# EAGLE design protoboard (EAGLE 7.7.0)
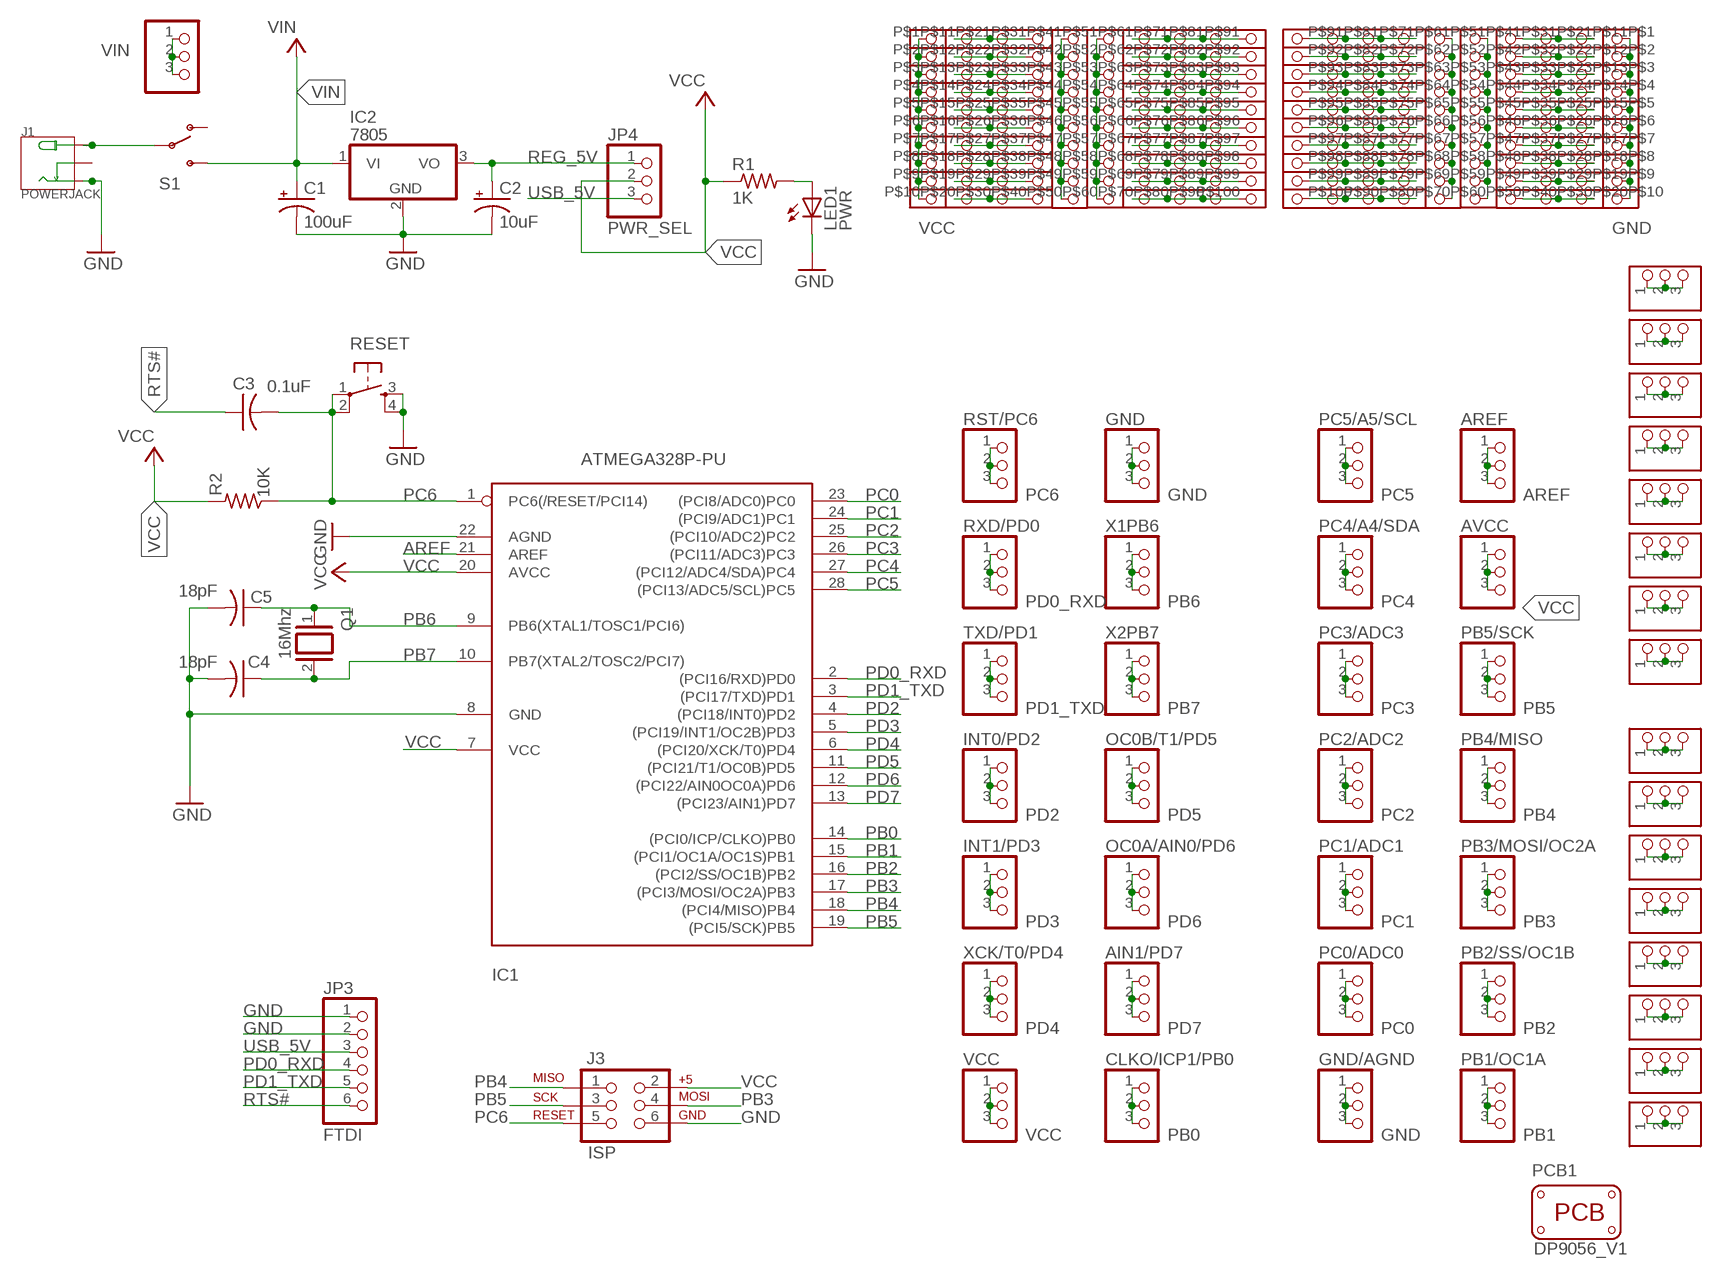
[diagram p0: schematic, sheet 1]

## Parts
AIN1/PD7  PINHD-1X3  [1X03]
AREF  PINHD-1X3  [1X03]
AVCC  PINHD-1X3  [1X03]
C1  100uF  CAP_POLPTH1  [CPOL-RADIAL-100UF-25V]
C2  10uF  CAP_POLPTH2  [CPOL-RADIAL-10UF-25V]
C3  0.1uF  C-US025-025X050  [C025-025X050]
C4  18pF  C-US025-025X050  [C025-025X050]
C5  18pF  C-US025-025X050  [C025-025X050]
CLKO/ICP1/PB0  PINHD-1X3  [1X03]
GND  PINHD-1X3  [1X03]
GND/AGND  PINHD-1X3  [1X03]
IC1  ATMEGA328P-PU  ATMEGA168-20P  [DIL28-3]
IC2  7805  7805T  [TO220H]
INT0/PD2  PINHD-1X3  [1X03]
INT1/PD3  PINHD-1X3  [1X03]
J1  POWERJACK  JACK-DC-3P-3410020P1  [PW-3P-2.1]
J3  ISP  AVR_SPI_PRG_6PTH  [2X3]
JP3  FTDI  PINHD-1X6  [1X06]
JP4  PWR_SEL  PINHD-1X3  [1X03]
LED1  PWR  LED3MM  [LED3MM]
OC0A/AIN0/PD6  PINHD-1X3  [1X03]
OC0B/T1/PD5  PINHD-1X3  [1X03]
PB1/OC1A  PINHD-1X3  [1X03]
PB2/SS/OC1B  PINHD-1X3  [1X03]
PB3/MOSI/OC2A  PINHD-1X3  [1X03]
PB4/MISO  PINHD-1X3  [1X03]
PB5/SCK  PINHD-1X3  [1X03]
PC0/ADC0  PINHD-1X3  [1X03]
PC1/ADC1  PINHD-1X3  [1X03]
PC2/ADC2  PINHD-1X3  [1X03]
PC3/ADC3  PINHD-1X3  [1X03]
PC4/A4/SDA  PINHD-1X3  [1X03]
PC5/A5/SCL  PINHD-1X3  [1X03]
PCB1  PCB_DP_RECTANGLE-56X90  [DP9056_V1]
Q1  16Mhz  XTAL/S  [QS]
R1  1K  RESISTOR-1/4W  [0207/7]
R2  10K  RESISTOR-1/4W  [0207/7]
RESET  TAC_SWITCHPTH  [TACTILE-PTH]
RST/PC6  PINHD-1X3  [1X03]
RXD/PD0  PINHD-1X3  [1X03]
S1  SWITCH-SPDTPTH  [SWITCH-SPDT]
TXD/PD1  PINHD-1X3  [1X03]
U$1  PROTOFIELD-10X10  [PROTOFIELD-10X10]
U$3  PROTOFIELD-10X10  [PROTOFIELD-10X10]
U$4  PROTOFIELD-3  [PROTOFIELD-3]
U$5  PROTOFIELD-3  [PROTOFIELD-3]
U$6  PROTOFIELD-3  [PROTOFIELD-3]
U$7  PROTOFIELD-3  [PROTOFIELD-3]
U$8  PROTOFIELD-3  [PROTOFIELD-3]
U$9  PROTOFIELD-3  [PROTOFIELD-3]
U$10  PROTOFIELD-3  [PROTOFIELD-3]
U$11  PROTOFIELD-3  [PROTOFIELD-3]
U$12  PROTOFIELD-3  [PROTOFIELD-3]
U$13  PROTOFIELD-3  [PROTOFIELD-3]
U$14  PROTOFIELD-3  [PROTOFIELD-3]
U$15  PROTOFIELD-3  [PROTOFIELD-3]
U$16  PROTOFIELD-3  [PROTOFIELD-3]
U$17  PROTOFIELD-3  [PROTOFIELD-3]
U$18  PROTOFIELD-3  [PROTOFIELD-3]
U$19  PROTOFIELD-3  [PROTOFIELD-3]
VCC  PINHD-1X3  [1X03]
VIN  +9V  PINHD-1X3  [1X03]
X1PB6  PINHD-1X3  [1X03]
X2PB7  PINHD-1X3  [1X03]
XCK/T0/PD4  PINHD-1X3  [1X03]

## Nets
AREF: AREF.1 AREF.2 AREF.3 IC1.21(AREF)
GND: C1.2(-) C2.2(-) C4.2 C5.2 GND.1 GND.2 GND.3 GND/AGND.1 GND/AGND.2 GND/AGND.3 IC1.8(GND) IC1.22(AGND) IC2.2(GND) J1.-1(-) J3.6 JP3.1 JP3.2 LED1.K(C) RESET.3 RESET.4 U$3.P$1 U$3.P$2 U$3.P$3 U$3.P$4 U$3.P$5 U$3.P$6 U$3.P$7 U$3.P$8 U$3.P$9 U$3.P$10
N$1 [supply]: J1.+ S1.2(P)
N$2: LED1.A R1.2
N$4: U$4.1 U$4.2 U$4.3
N$5: U$5.1 U$5.2 U$5.3
N$6: U$6.1 U$6.2 U$6.3
N$7: U$7.1 U$7.2 U$7.3
N$8: U$8.1 U$8.2 U$8.3
N$9: U$9.1 U$9.2 U$9.3
N$10: U$10.1 U$10.2 U$10.3
N$11: U$11.1 U$11.2 U$11.3
N$12: U$12.1 U$12.2 U$12.3
N$13: U$13.1 U$13.2 U$13.3
N$14: U$14.1 U$14.2 U$14.3
N$15: U$15.1 U$15.2 U$15.3
N$16: U$16.1 U$16.2 U$16.3
N$17: U$17.1 U$17.2 U$17.3
N$18: U$18.1 U$18.2 U$18.3
N$19: U$19.1 U$19.2 U$19.3
N$20: U$1.P$41 U$1.P$42 U$1.P$43 U$1.P$44 U$1.P$45 U$1.P$46 U$1.P$47 U$1.P$48 U$1.P$49 U$1.P$50
N$21: U$1.P$51 U$1.P$52 U$1.P$53 U$1.P$54 U$1.P$55 U$1.P$56 U$1.P$57 U$1.P$58 U$1.P$59 U$1.P$60
N$22: U$1.P$61 U$1.P$71 U$1.P$81 U$1.P$91
N$23: U$1.P$62 U$1.P$72 U$1.P$82 U$1.P$92
N$24: U$1.P$63 U$1.P$73 U$1.P$83 U$1.P$93
N$25: U$1.P$64 U$1.P$74 U$1.P$84 U$1.P$94
N$26: U$1.P$65 U$1.P$75 U$1.P$85 U$1.P$95
N$27: U$1.P$66 U$1.P$76 U$1.P$86 U$1.P$96
N$28: U$1.P$67 U$1.P$77 U$1.P$87 U$1.P$97
N$29: U$1.P$68 U$1.P$78 U$1.P$88 U$1.P$98
N$30: U$1.P$69 U$1.P$79 U$1.P$89 U$1.P$99
N$31: U$1.P$70 U$1.P$80 U$1.P$90 U$1.P$100
N$32: U$1.P$11 U$1.P$21 U$1.P$31
N$33: U$1.P$12 U$1.P$22 U$1.P$32
N$34: U$1.P$13 U$1.P$23 U$1.P$33
N$35: U$1.P$14 U$1.P$24 U$1.P$34
N$36: U$1.P$15 U$1.P$25 U$1.P$35
N$37: U$1.P$16 U$1.P$26 U$1.P$36
N$38: U$1.P$17 U$1.P$27 U$1.P$37
N$39: U$1.P$18 U$1.P$28 U$1.P$38
N$40: U$1.P$19 U$1.P$29 U$1.P$39
N$41: U$1.P$20 U$1.P$30 U$1.P$40
N$42: U$3.P$61 U$3.P$71 U$3.P$81 U$3.P$91
N$43: U$3.P$62 U$3.P$72 U$3.P$82 U$3.P$92
N$44: U$3.P$63 U$3.P$73 U$3.P$83 U$3.P$93
N$45: U$3.P$64 U$3.P$74 U$3.P$84 U$3.P$94
N$46: U$3.P$65 U$3.P$75 U$3.P$85 U$3.P$95
N$47: U$3.P$66 U$3.P$76 U$3.P$86 U$3.P$96
N$48: U$3.P$67 U$3.P$77 U$3.P$87 U$3.P$97
N$49: U$3.P$68 U$3.P$78 U$3.P$88 U$3.P$98
N$50: U$3.P$69 U$3.P$79 U$3.P$89 U$3.P$99
N$51: U$3.P$70 U$3.P$80 U$3.P$90 U$3.P$100
N$52: U$3.P$51 U$3.P$52 U$3.P$53 U$3.P$54 U$3.P$55 U$3.P$56 U$3.P$57 U$3.P$58 U$3.P$59 U$3.P$60
N$53: U$3.P$41 U$3.P$42 U$3.P$43 U$3.P$44 U$3.P$45 U$3.P$46 U$3.P$47 U$3.P$48 U$3.P$49 U$3.P$50
N$54: U$3.P$11 U$3.P$21 U$3.P$31
N$55: U$3.P$12 U$3.P$22 U$3.P$32
N$56: U$3.P$13 U$3.P$23 U$3.P$33
N$57: U$3.P$14 U$3.P$24 U$3.P$34
N$58: U$3.P$15 U$3.P$25 U$3.P$35
N$59: U$3.P$16 U$3.P$26 U$3.P$36
N$60: U$3.P$17 U$3.P$27 U$3.P$37
N$61: U$3.P$18 U$3.P$28 U$3.P$38
N$62: U$3.P$19 U$3.P$29 U$3.P$39
N$63: U$3.P$20 U$3.P$30 U$3.P$40
PB0: CLKO/ICP1/PB0.1 CLKO/ICP1/PB0.2 CLKO/ICP1/PB0.3 IC1.14((PCI0/ICP/CLKO)PB0)
PB1: IC1.15((PCI1/OC1A/OC1S)PB1) PB1/OC1A.1 PB1/OC1A.2 PB1/OC1A.3
PB2: IC1.16((PCI2/SS/OC1B)PB2) PB2/SS/OC1B.1 PB2/SS/OC1B.2 PB2/SS/OC1B.3
PB3: IC1.17((PCI3/MOSI/OC2A)PB3) J3.4 PB3/MOSI/OC2A.1 PB3/MOSI/OC2A.2 PB3/MOSI/OC2A.3
PB4: IC1.18((PCI4/MISO)PB4) J3.1 PB4/MISO.1 PB4/MISO.2 PB4/MISO.3
PB5: IC1.19((PCI5/SCK)PB5) J3.3 PB5/SCK.1 PB5/SCK.2 PB5/SCK.3
PB6: C5.1 IC1.9(PB6(XTAL1/TOSC1/PCI6)) Q1.1 X1PB6.1 X1PB6.2 X1PB6.3
PB7: C4.1 IC1.10(PB7(XTAL2/TOSC2/PCI7)) Q1.2 X2PB7.1 X2PB7.2 X2PB7.3
PC0: IC1.23((PCI8/ADC0)PC0) PC0/ADC0.1 PC0/ADC0.2 PC0/ADC0.3
PC1: IC1.24((PCI9/ADC1)PC1) PC1/ADC1.1 PC1/ADC1.2 PC1/ADC1.3
PC2: IC1.25((PCI10/ADC2)PC2) PC2/ADC2.1 PC2/ADC2.2 PC2/ADC2.3
PC3: IC1.26((PCI11/ADC3)PC3) PC3/ADC3.1 PC3/ADC3.2 PC3/ADC3.3
PC4: IC1.27((PCI12/ADC4/SDA)PC4) PC4/A4/SDA.1 PC4/A4/SDA.2 PC4/A4/SDA.3
PC5: IC1.28((PCI13/ADC5/SCL)PC5) PC5/A5/SCL.1 PC5/A5/SCL.2 PC5/A5/SCL.3
PC6: C3.2 IC1.1(PC6(/RESET/PCI14)) J3.5 R2.1 RESET.1 RESET.2 RST/PC6.1 RST/PC6.2 RST/PC6.3
PD0_RXD: IC1.2((PCI16/RXD)PD0) JP3.4 RXD/PD0.1 RXD/PD0.2 RXD/PD0.3
PD1_TXD: IC1.3((PCI17/TXD)PD1) JP3.5 TXD/PD1.1 TXD/PD1.2 TXD/PD1.3
PD2: IC1.4((PCI18/INT0)PD2) INT0/PD2.1 INT0/PD2.2 INT0/PD2.3
PD3: IC1.5((PCI19/INT1/OC2B)PD3) INT1/PD3.1 INT1/PD3.2 INT1/PD3.3
PD4: IC1.6((PCI20/XCK/T0)PD4) XCK/T0/PD4.1 XCK/T0/PD4.2 XCK/T0/PD4.3
PD5: IC1.11((PCI21/T1/OC0B)PD5) OC0B/T1/PD5.1 OC0B/T1/PD5.2 OC0B/T1/PD5.3
PD6: IC1.12((PCI22/AIN0OC0A)PD6) OC0A/AIN0/PD6.1 OC0A/AIN0/PD6.2 OC0A/AIN0/PD6.3
PD7: AIN1/PD7.1 AIN1/PD7.2 AIN1/PD7.3 IC1.13((PCI23/AIN1)PD7)
REG_5V: C2.1(+) IC2.3(VO) JP4.1
RTS#: C3.1 JP3.6
USB_5V: JP3.3 JP4.3
VCC: AVCC.1 AVCC.2 AVCC.3 IC1.7(VCC) IC1.20(AVCC) J3.2 JP4.2 R1.1 R2.2 U$1.P$1 U$1.P$2 U$1.P$3 U$1.P$4 U$1.P$5 U$1.P$6 U$1.P$7 U$1.P$8 U$1.P$9 U$1.P$10 VCC.1 VCC.2 VCC.3
VIN [supply]: C1.1(+) IC2.1(VI) S1.3(S) VIN.1 VIN.2 VIN.3
Unconnected: J1.-2(CDN) S1.1(O)

## Library data of the parts
AIN1/PD7 AREF AVCC CLKO/ICP1/PB0 GND GND/AGND INT0/PD2 INT1/PD3 OC0A/AIN0/PD6 OC0B/T1/PD5 PB1/OC1A PB2/SS/OC1B PB3/MOSI/OC2A PB4/MISO PB5/SCK PC0/ADC0 PC1/ADC1 PC2/ADC2 PC3/ADC3 PC4/A4/SDA PC5/A5/SCL RST/PC6 RXD/PD0 TXD/PD1 VCC VIN X1PB6 X2PB7 XCK/T0/PD4 = ubiyubix:PINHD-1X3
C1 C2 = SparkFun-Passives:CAP_POL: Capacitor Polarized These are standard SMD and PTH capacitors. Normally 10uF, 47uF, and 100uF in electrolytic and tantalum varieties. Always verify the external diameter of the through hole cap, it varies with capacity, voltage, and manufacturer. The EIA devices should be standard.
C3-C5 = rcl:C-US: CAPACITOR, American symbol
IC1 = adafruit:ATMEGA168*P: MICROCONTROLLER 16 kBytes FLASH 1 kBytes SRAM 512 Bytes EEPROM USART 8-channel 10 bit ADC
IC2 = linear:78*: Positive VOLTAGE REGULATOR Source: http://cache.national.com/ds/LM/LM78L05.pdf http://www.fairchildsemi.com/ds/LM/LM7805.pdf
J1 = Connector:JACK-DC-3P
J3 = SparkFun-Connectors:AVR_SPI_PRG_6: AVR ISP 6 Pin This is the reduced ISP connector for AVR programming. Common on Arduino. This footprint will take up less PCB space and can be used with a 10-pin to 6-pin adapter such as SKU: BOB-08508
JP3 = adafruit:PINHD-1X6: PIN HEADER
JP4 = adafruit:PINHD-1X3: PIN HEADER
LED1 = adafruit:LED: LED OSRAM: - CHIPLED LG R971, LG N971, LY N971, LG Q971, LY Q971, LO R971, LY R971 LH N974, LH R974 LS Q976, LO Q976, LY Q976 LO Q996 - Hyper CHIPLED LW Q18S LB Q993, LB Q99A, LB R99A - SideLED LS A670, LO A670, LY A670, LG A670, LP A670 LB A673, LV A673, LT A673, LW A673 LH A674 LY A675 LS A676, LA A676, LO A676, LY A676, LW A676 LS A679, LY A679, LG A679 - Hyper Micro SIDELED® LS Y876, LA Y876, LO Y876, LY Y876 LT Y87S - SmartLED LW L88C, LW L88S LB L89C, LB L89S, LG L890 LS L89K, LO L89K, LY L89K LS L896, LA L896, LO L896, LY L896 - TOPLED LS T670, LO T670, LY T670, LG T670, LP T670 LSG T670, LSP T670, LSY T670, LOP T670, LYG T670 LG T671, LOG T671, LSG T671 LB T673, LV T673, LT T673, LW T673 LH T674 LS T676, LA T676, LO T676, LY T676, LB T676, LH T676, LSB T676, LW T676 LB T67C, LV T67C, LT T67C, LS T67K, LO T67K, LY T67K, LW E67C LS E67B, LA E67B, LO E67B, LY E67B, LB E67C, LV E67C, LT E67C LW T67C LS T679, LY T679, LG T679 LS T770, LO T770, LY T770, LG T770, LP T770 LB T773, LV T773, LT T773, LW T773 LH T774 LS E675, LA E675, LY E675, LS T675 LS T776, LA T776, LO T776, LY T776, LB T776 LHGB T686 LT T68C, LB T68C - Hyper Mini TOPLED® LB M676 - Mini TOPLED Santana® LG M470 LS M47K, LO M47K, LY M47K Source: http://www.osram.convergy.de/
PCB1 = dp_devices:PCB_DP_RECTANGLE: Dangerous Prototypes Standard Rectangular PCB sizes; PCB_SIZE: DP9056_V1
Q1 = SmartPrj:XTAL/S: CRYSTAL
R1 R2 = ubiyubix:RESISTOR-1/4W
RESET = SparkFun-Electromechanical:TAC_SWITCH: Momentary Switch Button commonly used for reset or general input. Spark Fun Electronics SKU : COM-00097
S1 = ubiyubix:SWITCH-SPDT: SPST Switch Simple slide switch. Spark Fun Electronics SKU : COM-00102
U$1 U$3 = ubiyubix:PROTOFIELD-10X10
U$4-U$19 = ubiyubix:PROTOFIELD-3

## Net classes
0 default: width 0.305 mm, clearance 0.305 mm
1 supply: width 0.406 mm

## Board
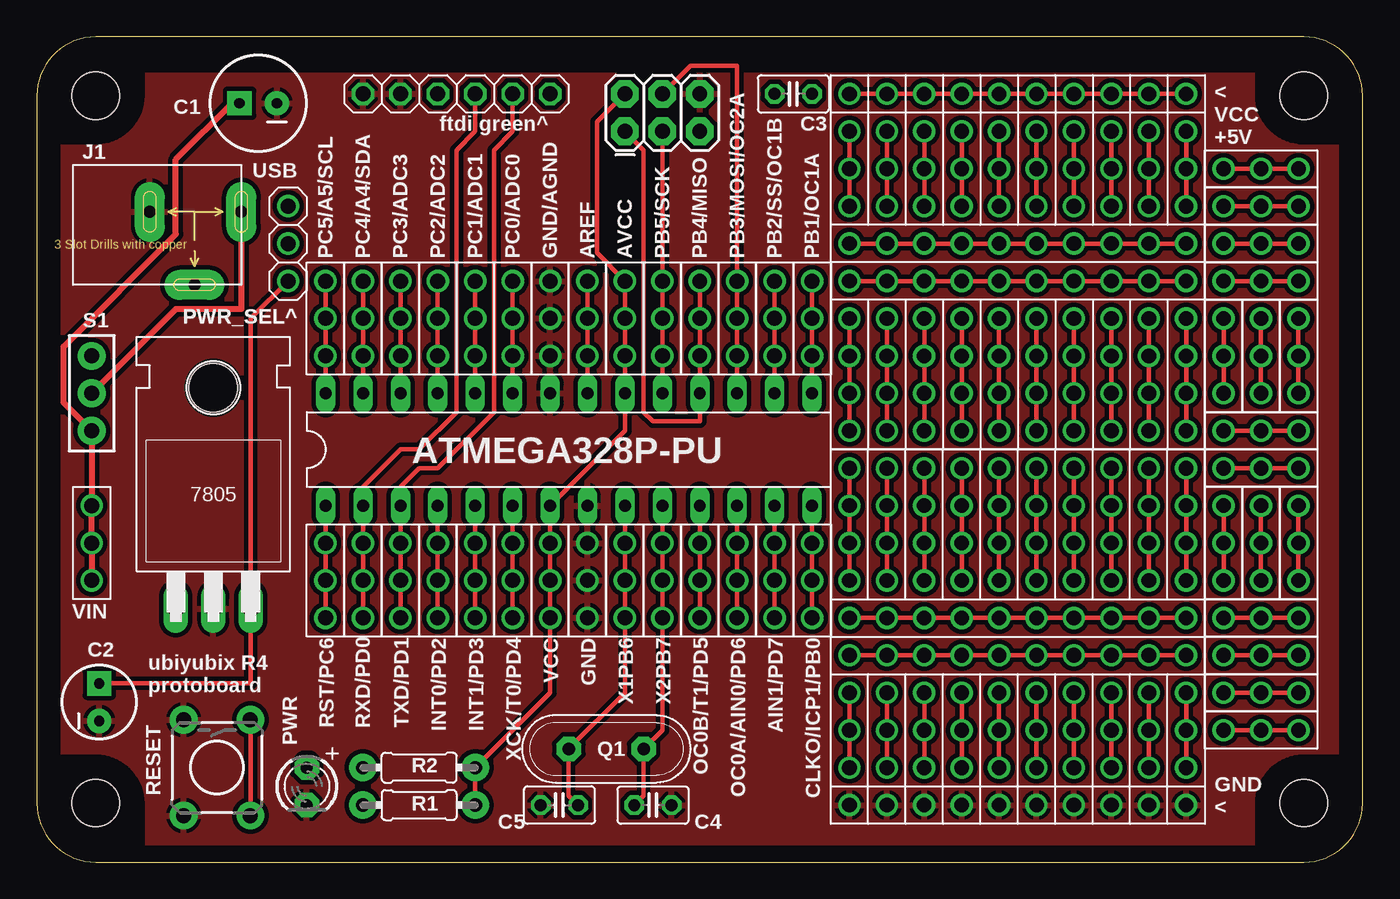
[diagram p1: board, top side]
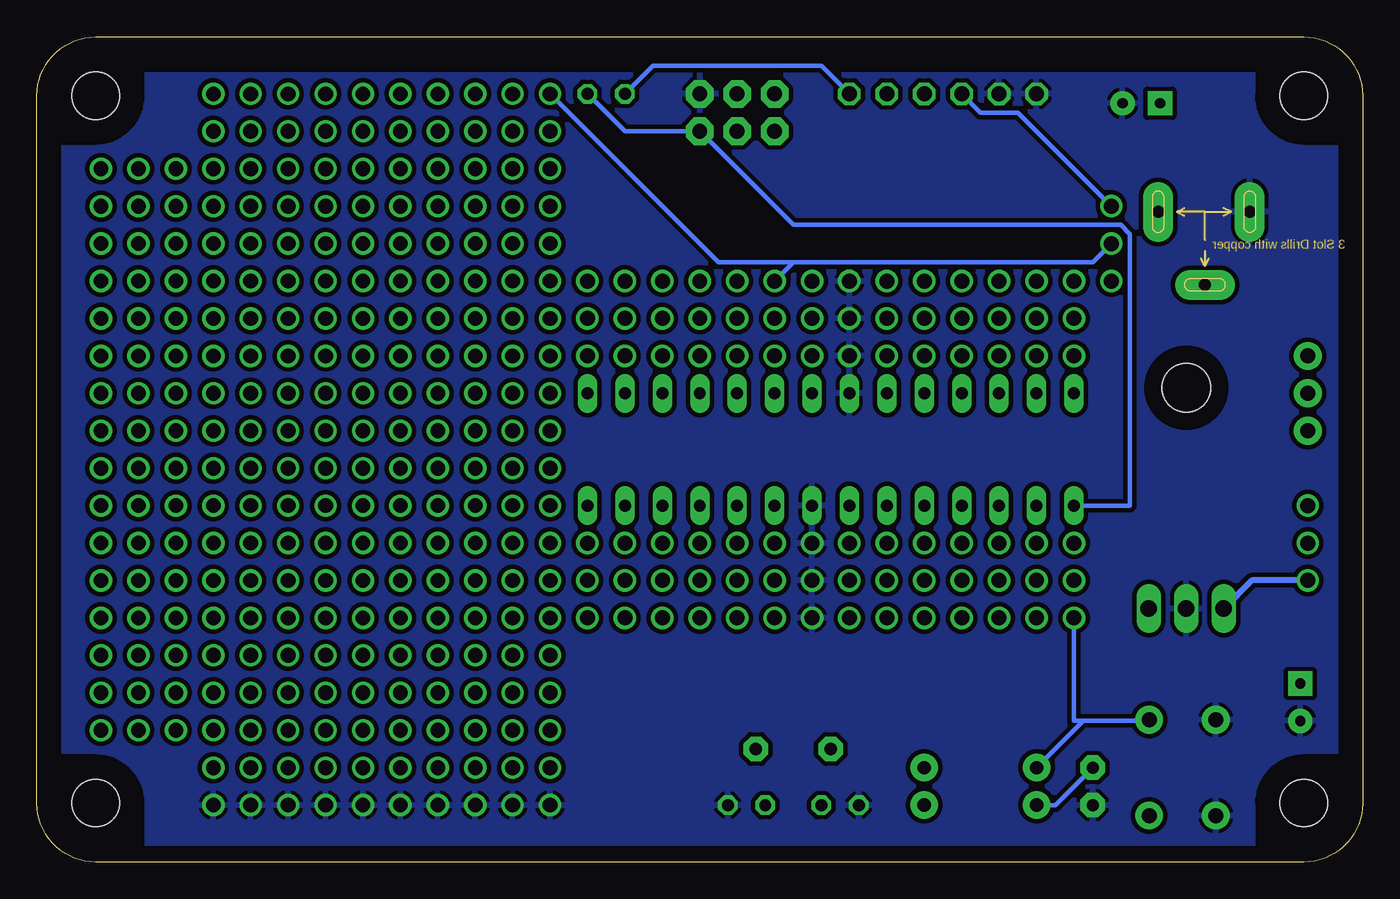
[diagram p2: board, bottom side, seen from below]

Size 90 x 56 mm. Coordinates in mm from the lower left corner, seen from the top.
Copper layers (1*16): Top 0.035mm / dielectric 1.5mm / Bottom 0.035mm
Design rules "SeeedStudio_2layer_DRU_no_angle_20140221": minimum track width 6mil, minimum drill 12mil, track to track 6mil, track to pad 6mil, pad to pad 6mil, via to via 6mil, smd to smd 0mil, copper to edge 10mil, drill to drill 10mil, minimum pad ring 10mil, minimum via ring 6mil, stop-mask expansion 2mil, vias tented up to drill 100mil, thermal gap 10mil

### Footprints (pad centres in the part's own frame; a part is rotated, then mirrored left to right if it is on the bottom)
1X03 = drill 1.016: 1 -2.54,0; 2 0,0; 3 2.54,0
CPOL-RADIAL-100UF-25V = drill 0.7 pad 1.651 square: 1 1.27,0 | drill 0.7 pad 1.651: 2 -1.27,0
CPOL-RADIAL-10UF-25V = drill 0.7 pad 1.651 square: 1 1.27,0 | drill 0.7 pad 1.651: 2 -1.27,0
C025-025X050 = drill 0.813 octagon: 1 -1.27,0; 2 1.27,0
DIL28-3 = drill 0.813 long: 1 -16.51,-3.81; 2 -13.97,-3.81; 3 -11.43,-3.81; 4 -8.89,-3.81; 5 -6.35,-3.81; 6 -3.81,-3.81; 7 -1.27,-3.81; 8 1.27,-3.81; 9 3.81,-3.81; 10 6.35,-3.81; 11 8.89,-3.81; 12 11.43,-3.81; 13 13.97,-3.81; 14 16.51,-3.81; 15 16.51,3.81; 16 13.97,3.81; 17 11.43,3.81; 18 8.89,3.81; 19 6.35,3.81; 20 3.81,3.81; 21 1.27,3.81; 22 -1.27,3.81; 23 -3.81,3.81; 24 -6.35,3.81; 25 -8.89,3.81; 26 -11.43,3.81; 27 -13.97,3.81; 28 -16.51,3.81
TO220H = drill 1.118 long: 1 -2.54,-10.16; 2 0,-10.16; 3 2.54,-10.16 | hole 3.302: 0,4.826
PW-3P-2.1 = drill 0.813 pad 2.032 long: + 6.985,0.889; -1 0.762,0.889; -2 3.81,-4.064
2X3 = drill 1.016 pad 1.88 octagon: 1 0,0; 2 0,2.54; 3 2.54,0; 4 2.54,2.54; 5 5.08,0; 6 5.08,2.54
1X06 = drill 1.016 octagon: 1 -6.35,0; 2 -3.81,0; 3 -1.27,0; 4 1.27,0; 5 3.81,0; 6 6.35,0
LED3MM = drill 0.813 pad 1.676 octagon: A -1.27,0; K 1.27,0
DP9056_V1 = hole 3.2: -41,-24; 41,-24; 41,24; -41,24
QS = drill 0.85 pad 1.676 octagon: 1 -2.54,0; 2 2.54,0
0207/7 = drill 0.9 pad 1.88: 1 -3.81,0; 2 3.81,0
TACTILE-PTH = drill 1.016 pad 1.88: 1 -3.251,2.261; 2 3.251,2.261; 3 -3.251,-2.261; 4 3.251,-2.261
SWITCH-SPDT = drill 1.016 pad 1.88: 1 0,2.54; 2 0,0; 3 0,-2.54
PROTOFIELD-10X10 = drill 1: P$1 -11.43,11.43; P$2 -11.43,8.89; P$3 -11.43,6.35; P$4 -11.43,3.81; P$5 -11.43,1.27; P$6 -11.43,-1.27; P$7 -11.43,-3.81; P$8 -11.43,-6.35; P$9 -11.43,-8.89; P$10 -11.43,-11.43; P$11 -8.89,11.43; P$12 -8.89,8.89; P$13 -8.89,6.35; P$14 -8.89,3.81; P$15 -8.89,1.27; P$16 -8.89,-1.27; P$17 -8.89,-3.81; P$18 -8.89,-6.35; P$19 -8.89,-8.89; P$20 -8.89,-11.43; P$21 -6.35,11.43; P$22 -6.35,8.89; P$23 -6.35,6.35; P$24 -6.35,3.81; P$25 -6.35,1.27; P$26 -6.35,-1.27; P$27 -6.35,-3.81; P$28 -6.35,-6.35; P$29 -6.35,-8.89; P$30 -6.35,-11.43; P$31 -3.81,11.43; P$32 -3.81,8.89; P$33 -3.81,6.35; P$34 -3.81,3.81; P$35 -3.81,1.27; P$36 -3.81,-1.27; P$37 -3.81,-3.81; P$38 -3.81,-6.35; P$39 -3.81,-8.89; P$40 -3.81,-11.43; P$41 -1.27,11.43; P$42 -1.27,8.89; P$43 -1.27,6.35; P$44 -1.27,3.81; P$45 -1.27,1.27; P$46 -1.27,-1.27; P$47 -1.27,-3.81; P$48 -1.27,-6.35; P$49 -1.27,-8.89; P$50 -1.27,-11.43; P$51 1.27,11.43; P$52 1.27,8.89; P$53 1.27,6.35; P$54 1.27,3.81; P$55 1.27,1.27; P$56 1.27,-1.27; P$57 1.27,-3.81; P$58 1.27,-6.35; P$59 1.27,-8.89; P$60 1.27,-11.43; P$61 3.81,11.43; P$62 3.81,8.89; P$63 3.81,6.35; P$64 3.81,3.81; P$65 3.81,1.27; P$66 3.81,-1.27; P$67 3.81,-3.81; P$68 3.81,-6.35; P$69 3.81,-8.89; P$70 3.81,-11.43; P$71 6.35,11.43; P$72 6.35,8.89; P$73 6.35,6.35; P$74 6.35,3.81; P$75 6.35,1.27; P$76 6.35,-1.27; P$77 6.35,-3.81; P$78 6.35,-6.35; P$79 6.35,-8.89; P$80 6.35,-11.43; P$81 8.89,11.43; P$82 8.89,8.89; P$83 8.89,6.35; P$84 8.89,3.81; P$85 8.89,1.27; P$86 8.89,-1.27; P$87 8.89,-3.81; P$88 8.89,-6.35; P$89 8.89,-8.89; P$90 8.89,-11.43; P$91 11.43,11.43; P$92 11.43,8.89; P$93 11.43,6.35; P$94 11.43,3.81; P$95 11.43,1.27; P$96 11.43,-1.27; P$97 11.43,-3.81; P$98 11.43,-6.35; P$99 11.43,-8.89; P$100 11.43,-11.43
PROTOFIELD-3 = drill 1: 1 0,2.54; 2 0,0; 3 0,-2.54

### Placement (x,y rotation side)
AIN1/PD7  50.08,19.11 90 top
AREF  37.38,36.89 90 top
AVCC  39.92,36.89 90 top
C1  15.03,51.5 180 top
C2  4.23,10.85 90 top
C3  51.35,52.13 0 top
C4  41.83,3.87 0 top
C5  35.48,3.87 180 top
CLKO/ICP1/PB0  52.62,19.11 90 top
GND  37.38,19.11 90 top
GND/AGND  34.84,36.89 90 top
IC1  36.11,28 0 top
IC2  11.98,27.36 0 top
INT0/PD2  27.22,19.11 90 top
INT1/PD3  29.76,19.11 90 top
J1  6.9,43.24 0 top
J3  39.92,49.59 0 top
JP3  28.49,52.13 0 top
JP4  17.06,41.97 90 top
LED1  18.33,5.14 270 top
OC0A/AIN0/PD6  47.54,19.11 90 top
OC0B/T1/PD5  45,19.11 90 top
PB1/OC1A  52.62,36.89 90 top
PB2/SS/OC1B  50.08,36.89 90 top
PB3/MOSI/OC2A  47.54,36.89 90 top
PB4/MISO  45,36.89 90 top
PB5/SCK  42.46,36.89 90 top
PC0/ADC0  32.3,36.89 90 top
PC1/ADC1  29.76,36.89 90 top
PC2/ADC2  27.22,36.89 90 top
PC3/ADC3  24.68,36.89 90 top
PC4/A4/SDA  22.14,36.89 90 top
PC5/A5/SCL  19.6,36.89 90 top
PCB1  45,28 0 top
Q1  38.65,7.68 0 top
R1  25.95,3.87 180 top
R2  25.95,6.41 0 top
RESET  12.23,6.41 270 top
RST/PC6  19.6,19.11 90 top
RXD/PD0  22.14,19.11 90 top
S1  3.73,31.81 0 top
TXD/PD1  24.68,19.11 90 top
U$1  66.59,40.7 270 top
U$3  66.59,15.3 90 top
U$4  83.1,47.05 90 top
U$5  83.1,44.51 90 top
U$6  83.1,41.97 90 top
U$7  83.1,39.43 90 top
U$8  83.1,29.27 270 top
U$9  85.64,34.35 180 top
U$10  83.1,34.35 180 top
U$11  80.56,34.35 180 top
U$12  83.1,26.73 90 top
U$13  80.56,21.65 180 top
U$14  83.1,21.65 180 top
U$15  85.64,21.65 180 top
U$16  83.1,16.57 90 top
U$17  83.1,14.03 90 top
U$18  83.1,11.49 90 top
U$19  83.1,8.95 90 top
VCC  34.84,19.11 90 top
VIN  3.73,21.65 270 top
X1PB6  39.92,19.11 90 top
X2PB7  42.46,19.11 90 top
XCK/T0/PD4  32.3,19.11 90 top

### Tracks (layer width: path | path; a pad name or v marks a point on that pad's centre or on a via)
AREF
  Top 0.305: IC1.21 AREF.1 AREF.2 AREF.3
GND
  pour Top (isolate 0.305): 3.09,53.4 86.91,53.4 arc-90 88.18,52.13 88.18,2.6 arc-90 86.91,1.33 3.09,1.33 arc-90 1.82,2.6 1.82,52.13 arc90
  pour Bottom (isolate 0.305): 3.09,53.4 85.64,53.4 arc-90 88.18,50.86 88.18,2.6 arc-90 86.91,1.33 3.09,1.33 arc-90 1.82,2.6 1.82,52.13 arc-90
N$1
  Top 0.406: S1.2 9.44,37.53 13.89,37.53 J1.+
N$2
  Bottom 0.305: LED1.A 20.87,3.87 R1.2
N$4
  Top 0.305: U$4.1 U$4.2 U$4.3
N$5
  Top 0.305: U$5.1 U$5.2 U$5.3
N$6
  Top 0.305: U$6.1 U$6.2 U$6.3
N$7
  Top 0.305: U$7.1 U$7.2 U$7.3
N$8
  Top 0.305: U$8.3 U$8.2 U$8.1
N$9
  Top 0.305: U$9.1 U$9.2 U$9.3
N$10
  Top 0.305: U$10.1 U$10.2 U$10.3
N$11
  Top 0.305: U$11.1 U$11.2 U$11.3
N$12
  Top 0.305: U$12.1 U$12.2 U$12.3
N$13
  Top 0.305: U$13.1 U$13.2 U$13.3
N$14
  Top 0.305: U$14.1 U$14.2 U$14.3
N$15
  Top 0.305: U$15.1 U$15.2 U$15.3
N$16
  Top 0.305: U$16.1 U$16.2 U$16.3
N$17
  Top 0.305: U$17.1 U$17.2 U$17.3
N$18
  Top 0.305: U$18.1 U$18.2 U$18.3
N$19
  Top 0.305: U$19.1 U$19.2 U$19.3
N$20
  Top 0.305: U$1.P$50 U$1.P$49 U$1.P$48 U$1.P$47 U$1.P$46 U$1.P$45 U$1.P$44 U$1.P$43 U$1.P$42 U$1.P$41
N$21
  Top 0.305: U$1.P$60 U$1.P$59 U$1.P$58 U$1.P$57 U$1.P$56 U$1.P$55 U$1.P$54 U$1.P$53 U$1.P$52 U$1.P$51
N$22
  Top 0.305: U$1.P$91 U$1.P$81 U$1.P$71 U$1.P$61
N$23
  Top 0.305: U$1.P$92 U$1.P$82 U$1.P$72 U$1.P$62
N$24
  Top 0.305: U$1.P$93 U$1.P$83 U$1.P$73 U$1.P$63
N$25
  Top 0.305: U$1.P$94 U$1.P$84 U$1.P$74 U$1.P$64
N$26
  Top 0.305: U$1.P$95 U$1.P$85 U$1.P$75 U$1.P$65
N$27
  Top 0.305: U$1.P$96 U$1.P$86 U$1.P$76 U$1.P$66
N$28
  Top 0.305: U$1.P$97 U$1.P$87 U$1.P$77 U$1.P$67
N$29
  Top 0.305: U$1.P$98 U$1.P$88 U$1.P$78 U$1.P$68
N$30
  Top 0.305: U$1.P$99 U$1.P$89 U$1.P$79 U$1.P$69
N$31
  Top 0.305: U$1.P$100 U$1.P$90 U$1.P$80 U$1.P$70
N$32
  Top 0.305: U$1.P$31 U$1.P$21 U$1.P$11
N$33
  Top 0.305: U$1.P$32 U$1.P$22 U$1.P$12
N$34
  Top 0.305: U$1.P$33 U$1.P$23 U$1.P$13
N$35
  Top 0.305: U$1.P$34 U$1.P$24 U$1.P$14
N$36
  Top 0.305: U$1.P$35 U$1.P$25 U$1.P$15
N$37
  Top 0.305: U$1.P$36 U$1.P$26 U$1.P$16
N$38
  Top 0.305: U$1.P$37 U$1.P$27 U$1.P$17
N$39
  Top 0.305: U$1.P$38 U$1.P$28 U$1.P$18
N$40
  Top 0.305: U$1.P$39 U$1.P$29 U$1.P$19
N$41
  Top 0.305: U$1.P$40 U$1.P$30 U$1.P$20
N$42
  Top 0.305: U$3.P$61 U$3.P$71 U$3.P$81 U$3.P$91
N$43
  Top 0.305: U$3.P$62 U$3.P$72 U$3.P$82 U$3.P$92
N$44
  Top 0.305: U$3.P$63 U$3.P$73 U$3.P$83 U$3.P$93
N$45
  Top 0.305: U$3.P$64 U$3.P$74 U$3.P$84 U$3.P$94
N$46
  Top 0.305: U$3.P$65 U$3.P$75 U$3.P$85 U$3.P$95
N$47
  Top 0.305: U$3.P$66 U$3.P$76 U$3.P$86 U$3.P$96
N$48
  Top 0.305: U$3.P$67 U$3.P$77 U$3.P$87 U$3.P$97
N$49
  Top 0.305: U$3.P$68 U$3.P$78 U$3.P$88 U$3.P$98
N$50
  Top 0.305: U$3.P$69 U$3.P$79 U$3.P$89 U$3.P$99
N$51
  Top 0.305: U$3.P$70 U$3.P$80 U$3.P$90 U$3.P$100
N$52
  Top 0.305: U$3.P$51 U$3.P$52 U$3.P$53 U$3.P$54 U$3.P$55 U$3.P$56 U$3.P$57 U$3.P$58 U$3.P$59 U$3.P$60
N$53
  Top 0.305: U$3.P$41 U$3.P$42 U$3.P$43 U$3.P$44 U$3.P$45 U$3.P$46 U$3.P$47 U$3.P$48 U$3.P$49 U$3.P$50
N$54
  Top 0.305: U$3.P$11 U$3.P$21 U$3.P$31
N$55
  Top 0.305: U$3.P$12 U$3.P$22 U$3.P$32
N$56
  Top 0.305: U$3.P$13 U$3.P$23 U$3.P$33
N$57
  Top 0.305: U$3.P$14 U$3.P$24 U$3.P$34
N$58
  Top 0.305: U$3.P$15 U$3.P$25 U$3.P$35
N$59
  Top 0.305: U$3.P$16 U$3.P$26 U$3.P$36
N$60
  Top 0.305: U$3.P$17 U$3.P$27 U$3.P$37
N$61
  Top 0.305: U$3.P$18 U$3.P$28 U$3.P$38
N$62
  Top 0.305: U$3.P$19 U$3.P$29 U$3.P$39
N$63
  Top 0.305: U$3.P$20 U$3.P$30 U$3.P$40
PB0
  Top 0.305: IC1.14 CLKO/ICP1/PB0.3 CLKO/ICP1/PB0.2 CLKO/ICP1/PB0.1
PB1
  Top 0.305: IC1.15 PB1/OC1A.1 PB1/OC1A.2 PB1/OC1A.3
PB2
  Top 0.305: IC1.16 PB2/SS/OC1B.1 PB2/SS/OC1B.2 PB2/SS/OC1B.3
PB3
  Top 0.305: IC1.17 PB3/MOSI/OC2A.1 PB3/MOSI/OC2A.2 PB3/MOSI/OC2A.3 47.54,54.03 44.37,54.03 J3.4
PB4
  Top 0.305: PB4/MISO.3 PB4/MISO.2 PB4/MISO.1 IC1.18 45,29.9 41.83,29.9 41.19,30.54 41.19,48.32 J3.1
PB5
  Top 0.305: IC1.19 PB5/SCK.1 PB5/SCK.2 PB5/SCK.3 J3.3
PB6
  Top 0.305: C5.1 36.11,4.5 Q1.1 39.92,11.49 X1PB6.1 X1PB6.2 X1PB6.3 IC1.9
PB7
  Top 0.305: C4.1 41.19,4.5 Q1.2 42.46,8.95 X2PB7.1 X2PB7.2 X2PB7.3 IC1.10
PC0
  Top 0.305: IC1.23 PC0/ADC0.1 PC0/ADC0.2 PC0/ADC0.3
PC1
  Top 0.305: IC1.24 PC1/ADC1.1 PC1/ADC1.2 PC1/ADC1.3
PC2
  Top 0.305: IC1.25 PC2/ADC2.1 PC2/ADC2.2 PC2/ADC2.3
PC3
  Top 0.305: IC1.26 PC3/ADC3.1 PC3/ADC3.2 PC3/ADC3.3
PC4
  Top 0.305: IC1.27 PC4/A4/SDA.1 PC4/A4/SDA.2 PC4/A4/SDA.3
PC5
  Top 0.305: IC1.28 PC5/A5/SCL.1 PC5/A5/SCL.2 PC5/A5/SCL.3
PC6
  Top 0.305: IC1.1 RST/PC6.3 RST/PC6.2 RST/PC6.1 | RESET.2 14.52,3.23 14.52,9.58 RESET.1
  Bottom 0.305: C3.2 50.08,49.59 J3.5 38.65,43.24 16.43,43.24 15.79,42.61 15.79,24.19 IC1.1 | 18.96,9.58 R2.1 | 18.96,9.58 14.52,9.58 RESET.1 | RST/PC6.1 19.6,9.58 18.96,9.58
PD0_RXD
  Top 0.305: RXD/PD0.1 RXD/PD0.2 RXD/PD0.3 IC1.2 22.14,25.46 24.68,28 25.95,28 28.49,30.54 28.49,48.32 29.76,49.59 JP3.4
PD1_TXD
  Top 0.305: TXD/PD1.1 TXD/PD1.2 TXD/PD1.3 IC1.3 24.68,25.46 25.95,26.73 27.22,26.73 31.03,30.54 31.03,48.32 32.3,49.59 JP3.5
PD2
  Top 0.305: IC1.4 INT0/PD2.3 INT0/PD2.2 INT0/PD2.1
PD3
  Top 0.305: IC1.5 INT1/PD3.3 INT1/PD3.2 INT1/PD3.1
PD4
  Top 0.305: IC1.6 XCK/T0/PD4.3 XCK/T0/PD4.2 XCK/T0/PD4.1
PD5
  Top 0.305: IC1.11 OC0B/T1/PD5.3 OC0B/T1/PD5.2 OC0B/T1/PD5.1
PD6
  Top 0.305: IC1.12 OC0A/AIN0/PD6.3 OC0A/AIN0/PD6.2 OC0A/AIN0/PD6.1
PD7
  Top 0.305: IC1.13 AIN1/PD7.3 AIN1/PD7.2 AIN1/PD7.1
REG_5V
  Top 0.305: JP4.1 14.52,36.89 IC2.3 14.52,12.12 C2.1
RTS#
  Bottom 0.305: C3.1 48.18,54.03 36.75,54.03 JP3.6
USB_5V
  Bottom 0.305: JP4.3 23.41,50.86 25.95,50.86 JP3.3
VCC
  Top 0.305: R1.1 R2.2 34.84,11.49 VCC.1 VCC.2 VCC.3 IC1.7 39.92,29.27 IC1.20 AVCC.1 AVCC.2 AVCC.3 38.02,41.33 38.02,50.22 J3.2 | U$1.P$10 U$1.P$9 U$1.P$8 U$1.P$7 U$1.P$6 U$1.P$5 U$1.P$4 U$1.P$3 U$1.P$2 U$1.P$1
  Bottom 0.305: JP4.2 18.33,40.7 38.65,40.7 | AVCC.3 38.65,40.7 | U$1.P$10 43.73,40.7 38.65,40.7
VIN
  Top 0.406: VIN.3 VIN.2 VIN.1 S1.3 1.82,31.17 1.82,34.98 9.44,42.61 9.44,47.69 13.25,51.5 C1.1
  Bottom 0.406: IC2.1 7.54,19.11 VIN.3

### Text on the board
tNames: < / VCC / +5V | ftdi green^ | USB | PWR_SEL^ | PWR_SEL^ | ubiyubix R4 / protoboard | GND / <